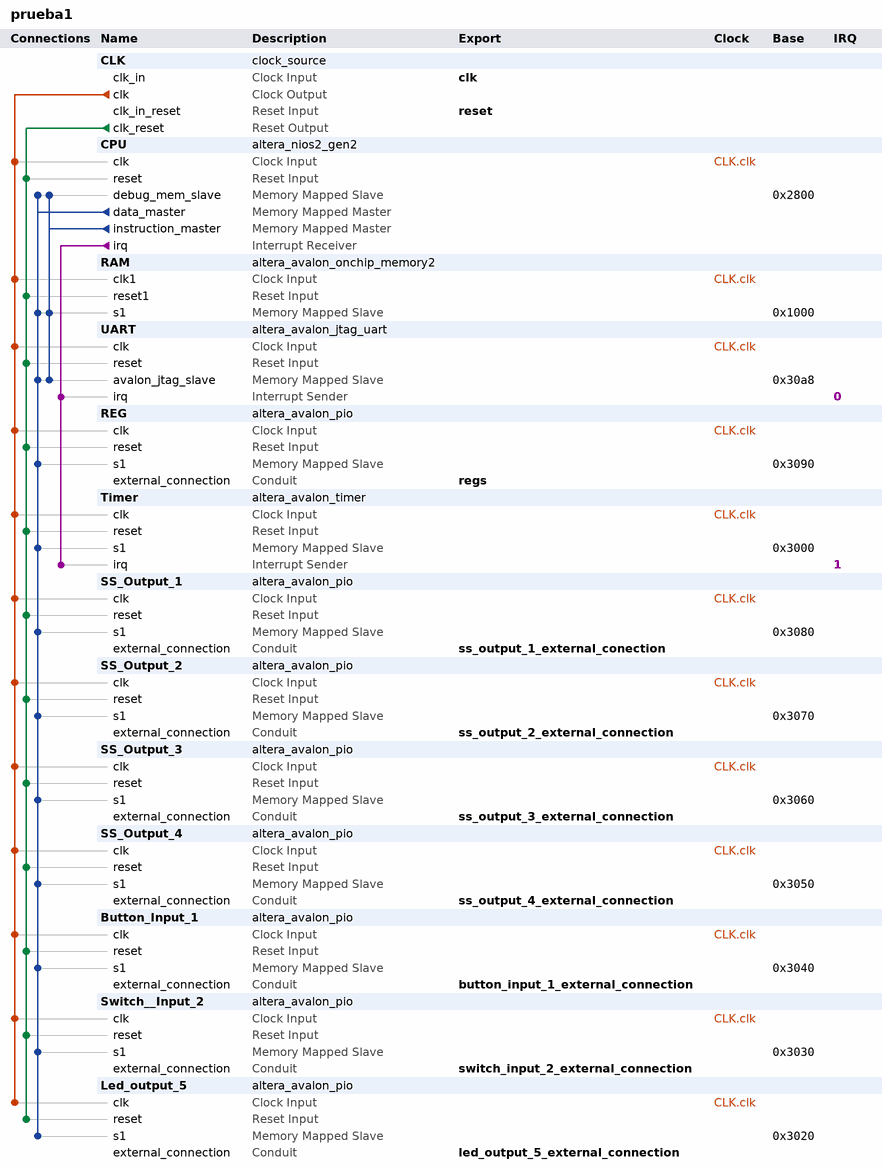
[diagram p0: system contents]
# Platform Designer (Qsys) system prueba1, Cyclone V 5CEBA2F17A7
# Parameters at their usual value, and those the tool derives, are not listed.
package require -exact qsys 19.1
create_system prueba1
set_project_property DEVICE_FAMILY {Cyclone V}
set_project_property DEVICE 5CEBA2F17A7

add_instance CLK clock_source 19.1
set_instance_parameter_value CLK clockFrequency 50000000

add_instance CPU altera_nios2_gen2 19.1
set_instance_parameter_value CPU dcache_size 2048
set_instance_parameter_value CPU exceptionSlave RAM.s1
set_instance_parameter_value CPU icache_size 4096
set_instance_parameter_value CPU impl Tiny
set_instance_parameter_value CPU resetSlave RAM.s1

add_instance RAM altera_avalon_onchip_memory2 19.1
set_instance_parameter_value RAM dataWidth 32
set_instance_parameter_value RAM dualPort false
set_instance_parameter_value RAM initMemContent true
set_instance_parameter_value RAM initializationFileName onchip_mem.hex
set_instance_parameter_value RAM memorySize 4096

add_instance UART altera_avalon_jtag_uart 19.1
set_instance_parameter_value UART simInteractiveOptions NO_INTERACTIVE_WINDOWS

add_instance REG altera_avalon_pio 19.1
set_instance_parameter_value REG direction Output
set_instance_parameter_value REG width 8

add_instance Timer altera_avalon_timer 19.1
set_instance_parameter_value Timer period 100
set_instance_parameter_value Timer periodUnits MSEC

add_instance SS_Output_1 altera_avalon_pio 19.1
set_instance_parameter_value SS_Output_1 direction Output
set_instance_parameter_value SS_Output_1 width 8

add_instance SS_Output_2 altera_avalon_pio 19.1
set_instance_parameter_value SS_Output_2 direction Output
set_instance_parameter_value SS_Output_2 width 8

add_instance SS_Output_3 altera_avalon_pio 19.1
set_instance_parameter_value SS_Output_3 direction Output
set_instance_parameter_value SS_Output_3 width 8

add_instance SS_Output_4 altera_avalon_pio 19.1
set_instance_parameter_value SS_Output_4 direction Output
set_instance_parameter_value SS_Output_4 width 8

add_instance Button_Input_1 altera_avalon_pio 19.1
set_instance_parameter_value Button_Input_1 direction Input
set_instance_parameter_value Button_Input_1 width 3

add_instance Switch__Input_2 altera_avalon_pio 19.1
set_instance_parameter_value Switch__Input_2 direction Input
set_instance_parameter_value Switch__Input_2 width 3

add_instance Led_output_5 altera_avalon_pio 19.1
set_instance_parameter_value Led_output_5 direction Output
set_instance_parameter_value Led_output_5 width 8

# connections
add_connection CLK.clk Button_Input_1.clk clock
add_connection CLK.clk CPU.clk clock
add_connection CLK.clk Led_output_5.clk clock
add_connection CLK.clk RAM.clk1 clock
add_connection CLK.clk REG.clk clock
add_connection CLK.clk SS_Output_1.clk clock
add_connection CLK.clk SS_Output_2.clk clock
add_connection CLK.clk SS_Output_3.clk clock
add_connection CLK.clk SS_Output_4.clk clock
add_connection CLK.clk Switch__Input_2.clk clock
add_connection CLK.clk Timer.clk clock
add_connection CLK.clk UART.clk clock
add_connection CLK.clk_reset Button_Input_1.reset reset
add_connection CLK.clk_reset CPU.reset reset
add_connection CLK.clk_reset Led_output_5.reset reset
add_connection CLK.clk_reset RAM.reset1 reset
add_connection CLK.clk_reset REG.reset reset
add_connection CLK.clk_reset SS_Output_1.reset reset
add_connection CLK.clk_reset SS_Output_2.reset reset
add_connection CLK.clk_reset SS_Output_3.reset reset
add_connection CLK.clk_reset SS_Output_4.reset reset
add_connection CLK.clk_reset Switch__Input_2.reset reset
add_connection CLK.clk_reset Timer.reset reset
add_connection CLK.clk_reset UART.reset reset
add_connection CPU.data_master Button_Input_1.s1 avalon
set_connection_parameter_value CPU.data_master/Button_Input_1.s1 baseAddress 0x3040
add_connection CPU.data_master CPU.debug_mem_slave avalon
set_connection_parameter_value CPU.data_master/CPU.debug_mem_slave baseAddress 0x2800
add_connection CPU.data_master Led_output_5.s1 avalon
set_connection_parameter_value CPU.data_master/Led_output_5.s1 baseAddress 0x3020
add_connection CPU.data_master RAM.s1 avalon
set_connection_parameter_value CPU.data_master/RAM.s1 baseAddress 0x1000
add_connection CPU.data_master REG.s1 avalon
set_connection_parameter_value CPU.data_master/REG.s1 baseAddress 0x3090
add_connection CPU.data_master SS_Output_1.s1 avalon
set_connection_parameter_value CPU.data_master/SS_Output_1.s1 baseAddress 0x3080
add_connection CPU.data_master SS_Output_2.s1 avalon
set_connection_parameter_value CPU.data_master/SS_Output_2.s1 baseAddress 0x3070
add_connection CPU.data_master SS_Output_3.s1 avalon
set_connection_parameter_value CPU.data_master/SS_Output_3.s1 baseAddress 0x3060
add_connection CPU.data_master SS_Output_4.s1 avalon
set_connection_parameter_value CPU.data_master/SS_Output_4.s1 baseAddress 0x3050
add_connection CPU.data_master Switch__Input_2.s1 avalon
set_connection_parameter_value CPU.data_master/Switch__Input_2.s1 baseAddress 0x3030
add_connection CPU.data_master Timer.s1 avalon
set_connection_parameter_value CPU.data_master/Timer.s1 baseAddress 0x3000
add_connection CPU.data_master UART.avalon_jtag_slave avalon
set_connection_parameter_value CPU.data_master/UART.avalon_jtag_slave baseAddress 0x30a8
add_connection CPU.instruction_master CPU.debug_mem_slave avalon
set_connection_parameter_value CPU.instruction_master/CPU.debug_mem_slave baseAddress 0x2800
add_connection CPU.instruction_master RAM.s1 avalon
set_connection_parameter_value CPU.instruction_master/RAM.s1 baseAddress 0x1000
add_connection CPU.instruction_master UART.avalon_jtag_slave avalon
set_connection_parameter_value CPU.instruction_master/UART.avalon_jtag_slave baseAddress 0x30a8
add_connection CPU.irq Timer.irq interrupt
set_connection_parameter_value CPU.irq/Timer.irq irqNumber 1
add_connection CPU.irq UART.irq interrupt
set_connection_parameter_value CPU.irq/UART.irq irqNumber 0

# exported interfaces
add_interface button_input_1_external_connection conduit end
set_interface_property button_input_1_external_connection EXPORT_OF Button_Input_1.external_connection
add_interface clk clock sink
set_interface_property clk EXPORT_OF CLK.clk_in
add_interface led_output_5_external_connection conduit end
set_interface_property led_output_5_external_connection EXPORT_OF Led_output_5.external_connection
add_interface regs conduit end
set_interface_property regs EXPORT_OF REG.external_connection
add_interface reset reset sink
set_interface_property reset EXPORT_OF CLK.clk_in_reset
add_interface ss_output_1_external_conection conduit end
set_interface_property ss_output_1_external_conection EXPORT_OF SS_Output_1.external_connection
add_interface ss_output_2_external_connection conduit end
set_interface_property ss_output_2_external_connection EXPORT_OF SS_Output_2.external_connection
add_interface ss_output_3_external_connection conduit end
set_interface_property ss_output_3_external_connection EXPORT_OF SS_Output_3.external_connection
add_interface ss_output_4_external_connection conduit end
set_interface_property ss_output_4_external_connection EXPORT_OF SS_Output_4.external_connection
add_interface switch_input_2_external_connection conduit end
set_interface_property switch_input_2_external_connection EXPORT_OF Switch__Input_2.external_connection

set_interconnect_requirement {$system} qsys_mm.clockCrossingAdapter HANDSHAKE
set_interconnect_requirement {$system} qsys_mm.enableEccProtection FALSE
set_interconnect_requirement {$system} qsys_mm.insertDefaultSlave FALSE
set_interconnect_requirement {$system} qsys_mm.maxAdditionalLatency 1

save_system prueba1.qsys
